# Altium schematic sheet QUTMS_Radio_Pod.SchDoc: Radio Pod
size A4
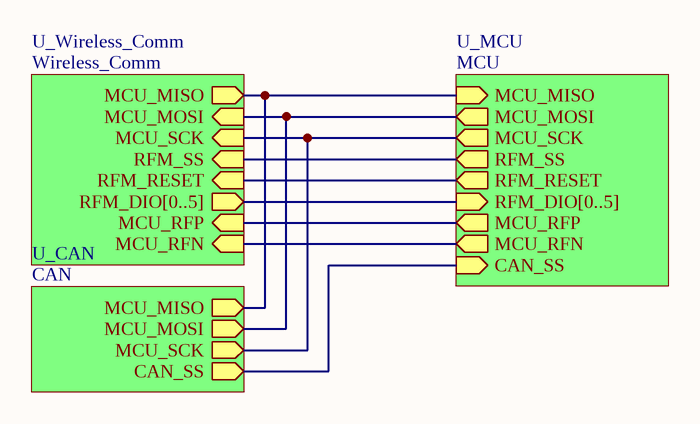
[diagram p0: QUTMS_Radio_Pod.SchDoc]

## Sub-sheets
U_CAN = CAN: MCU_MISO (out), MCU_MOSI (out), MCU_SCK (out), CAN_SS (out)
U_MCU = MCU: MCU_MISO (in), MCU_MOSI (out), MCU_SCK (out), RFM_SS (out), RFM_RESET (out), RFM_DIO[0..5] (in), MCU_RFP (out), MCU_RFN (out), CAN_SS (in)
U_Wireless_Comm = Wireless_Comm: MCU_MISO (out), MCU_MOSI (in), MCU_SCK (in), RFM_SS (in), RFM_RESET (in), RFM_DIO[0..5] (out), MCU_RFP (in), MCU_RFN (in)

## Nets
(unnamed): sheet U_Wireless_Comm/MCU_MISO, sheet U_CAN/MCU_MISO, sheet U_MCU/MCU_MISO
(unnamed): sheet U_Wireless_Comm/MCU_MOSI, sheet U_CAN/MCU_MOSI, sheet U_MCU/MCU_MOSI
(unnamed): sheet U_Wireless_Comm/MCU_SCK, sheet U_CAN/MCU_SCK, sheet U_MCU/MCU_SCK
(unnamed): sheet U_Wireless_Comm/RFM_SS, sheet U_MCU/RFM_SS
(unnamed): sheet U_Wireless_Comm/RFM_RESET, sheet U_MCU/RFM_RESET
(unnamed): sheet U_Wireless_Comm/MCU_RFP, sheet U_MCU/MCU_RFP
(unnamed): sheet U_Wireless_Comm/MCU_RFN, sheet U_MCU/MCU_RFN
(unnamed): sheet U_CAN/CAN_SS, sheet U_MCU/CAN_SS

## Buses and harness runs
bus sheet U_MCU/RFM_DIO[0..5] = sheet U_Wireless_Comm/RFM_DIO[0..5]

## Notes on the sheet
- Title
- Size:
- Date:
- A4
- Number:
- Time:
- Revision:
- Sheet
- of
- File: